# Altium schematic sheet Kivipallur_joonis3_toide.SchDoc
size A4; SheetNumber: 4; SheetTotal: 4
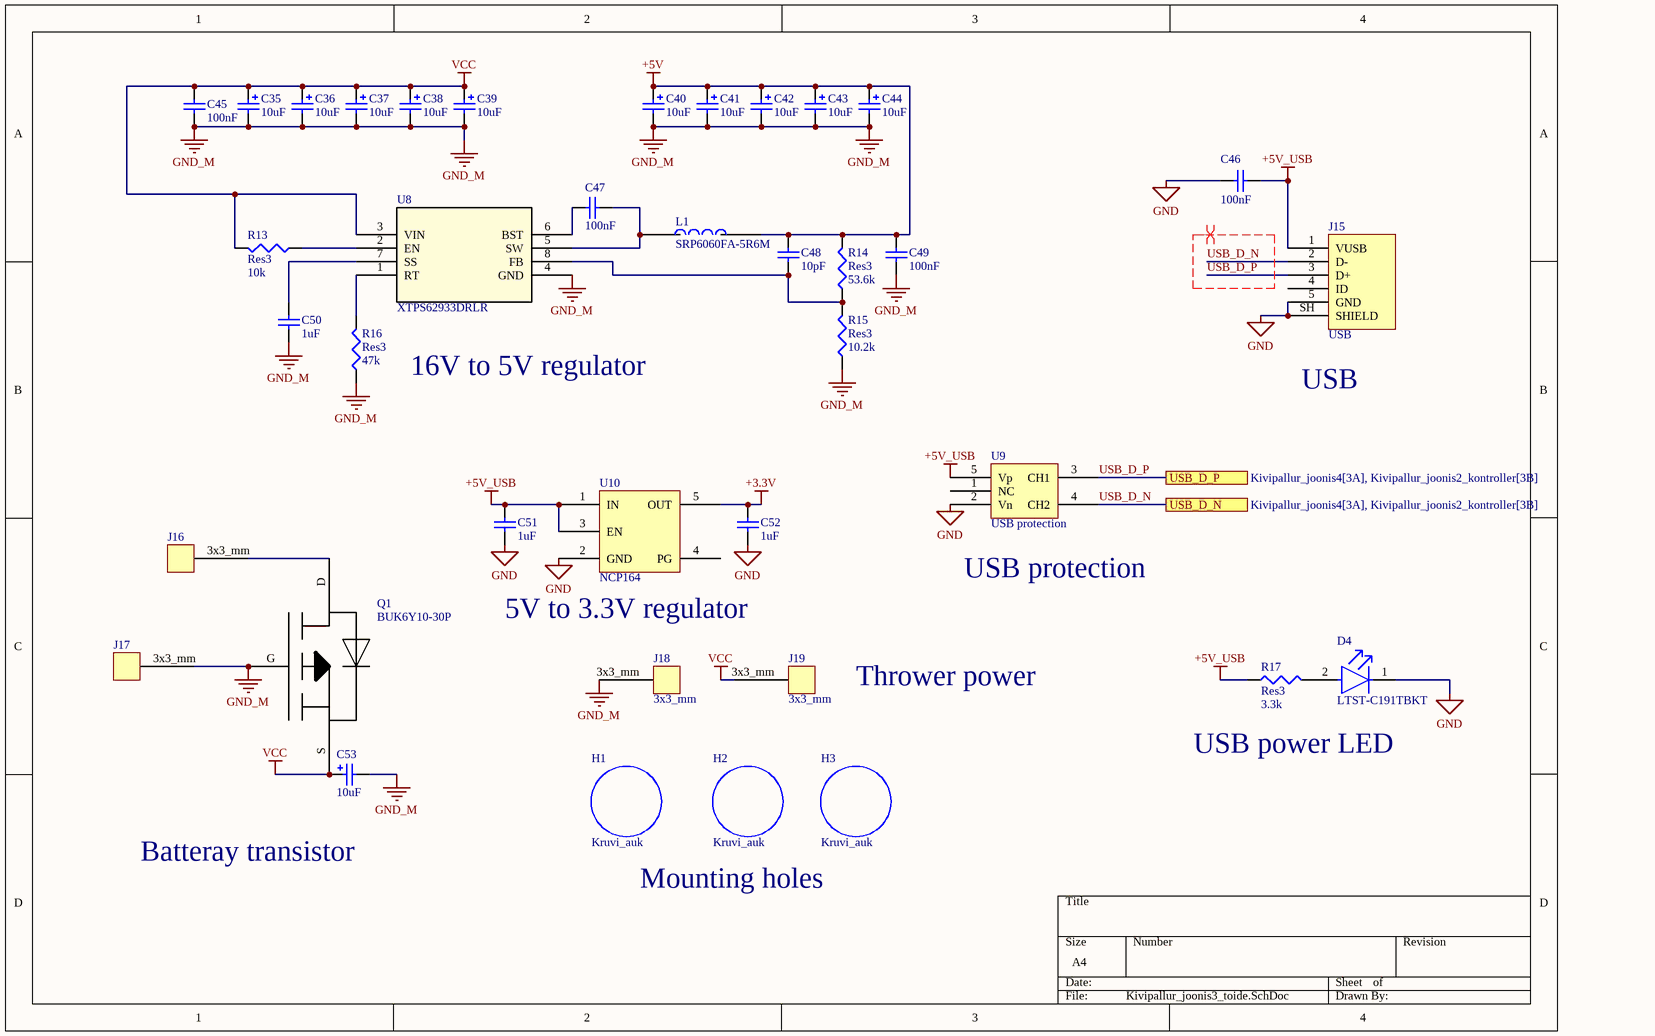
[diagram p0: Kivipallur_joonis3_toide.SchDoc]

## Parts
C35  value 10uF  [C0805]  (hidden comment: Cap Pol3)
C36  value 10uF  [C0805]  (hidden comment: Cap Pol3)
C37  value 10uF  [C0805]  (hidden comment: Cap Pol3)
C38  value 10uF  [C0805]  (hidden comment: Cap Pol3)
C39  value 10uF  [C0805]  (hidden comment: Cap Pol3)
C40  value 10uF  [C0805]  (hidden comment: Cap Pol3)
C41  value 10uF  [C0805]  (hidden comment: Cap Pol3)
C42  value 10uF  [C0805]  (hidden comment: Cap Pol3)
C43  value 10uF  [C0805]  (hidden comment: Cap Pol3)
C44  value 10uF  [C0805]  (hidden comment: Cap Pol3)
C45  value 100nF  [1608[0603]]  (hidden comment: Cap Semi)
C46  value 100nF  [1608[0603]]  (hidden comment: Cap Semi)
C47  value 100nF  [1608[0603]]  (hidden comment: Cap Semi)
C48  value 10pF  [1608[0603]]  (hidden comment: Cap Semi)
C49  value 100nF  [1608[0603]]  (hidden comment: Cap Semi)
C50  value 1uF  [1608[0603]]  (hidden comment: Cap Semi)
C51  value 1uF  [1608[0603]]  (hidden comment: Cap Semi)
C52  value 1uF  [1608[0603]]  (hidden comment: Cap Semi)
C53  value 10uF  [C0805]  (hidden comment: Cap Pol3)
D4  LTST-C191TBKT  [FP-LTST-C191TBKT-MFG]
H1  Kruvi_auk  [kruvi_auk]
H2  Kruvi_auk  [kruvi_auk]
H3  Kruvi_auk  [kruvi_auk]
J15  USB  [USB]
J16  3x3_mm  [3x3_mm]  (value not drawn)
J17  3x3_mm  [3x3_mm]  (value not drawn)
J18  3x3_mm  [3x3_mm]
J19  3x3_mm  [3x3_mm]
L1  SRP6060FA-5R6M  [test alus]
Q1  BUK6Y10-30P  [BUK6Y10-30P]
R13  Res3  value 10k  [J1-0603]
R14  Res3  value 53.6k  [J1-0603]
R15  Res3  value 10.2k  [J1-0603]
R16  Res3  value 47k  [J1-0603]
R17  Res3  value 3.3k  [J1-0603]
U8  XTPS62933DRLR  [SOT_33DRLR_TEX]
U9  USB protection  [USB_PROTECTION_3]
U10  NCP164  [NCP164_2]

## Ports
USB_D_N (see Kivipallur_joonis4[3A], Kivipallur_joonis2_kontroller[3B]), USB_D_P (see Kivipallur_joonis4[3A], Kivipallur_joonis2_kontroller[3B])

## Nets
+3.3V: C52.1 U10.5(OUT)
+5V: C40.1 C41.1 C42.1 C43.1 C44.1 C48.1 C49.1 L1.2 R14.2
+5V_USB: C46.1 C51.1 J15.1(VUSB) R17.1 U9.5(Vp) U10.1(IN) U10.3(EN)
GND: C46.2 C51.2 C52.2 D4.1(C) J15.5(GND) J15.SH(SHIELD) U9.2(Vn) U10.2(GND)
GND_M: C35.2 C36.2 C37.2 C38.2 C39.2 C40.2 C41.2 C42.2 C43.2 C44.2 C45.2 C49.2 C50.2 C53.2 J17.3x3_mm J18.3x3_mm Q1.G R15.1 R16.1 U8.4(GND)
VCC: C35.1 C36.1 C37.1 C38.1 C39.1 C45.1 C53.1 J19.3x3_mm Q1.S R13.2 U8.3(VIN)
USB_D_N: J15.2(D-) U9.4(CH2) ; port USB_D_N
USB_D_P: J15.3(D+) U9.3(CH1) ; port USB_D_P
NetC47_1: C47.1 U8.6(BST)
NetC47_2: C47.2 L1.1 U8.5(SW)
NetC48_2: C48.2 R14.1 R15.2 U8.8(FB)
NetC50_1: C50.1 U8.7(SS)
NetD4_2: D4.2(A) R17.2
NetJ16_3x3_mm: J16.3x3_mm Q1.D
NetR13_1: R13.1 U8.2(EN)
NetR16_2: R16.2 U8.1(RT)

Not connected (* = marked no-connect by the designer): J15 4(ID); U9 1(NC); U10 4(PG)

## Layout directives
differential pair; differential pair class USB: USB_D_N, USB_D_P

## Notes on the sheet
- 16V to 5V regulator
- (near J15) USB
- (near U9) USB protection
- 5V to 3.3V regulator
- Thrower power
- USB power LED
- Batteray transistor
- Mounting holes

## Library data of the parts
C35-C44 C53 = Cap Pol3: Polarized Capacitor (Surface Mount); Published: 8-Jun-2000; PackageReference: C0805; Publisher: Altium Limited; PackageDescription: Chip Capacitor; LatestRevisionDate: 29-May-2009; LatestRevisionNote: IPC-7351 Footprint Added.
C45-C52 = Cap Semi: Capacitor (Semiconductor SIM Model); Published: 8-Jun-2000; PackageReference: C1206; Publisher: Altium Limited; PackageDescription: Chip Capacitor; LatestRevisionDate: 29-May-2009; LatestRevisionNote: IPC-7351 Footprint Added.
D4 = CMP-22017-000008-1: LED BLUE CLEAR CHIP SMD; Lens Color: Colorless; Dominant Wavelength: 475nm; Forward Current: 20mA; Wavelength: 468nm; Viewing Angle: 130°; Power Dissipation: 76mW; Luminous Intensity: 180mcd; Reverse Voltage: 5V; Number of Elements: 1; Lens Style: Diffused; Forward Voltage: 3.8V; Max Power Dissipation: 75mW; Case Code (Metric): 1608; Packaging: Tape and Reel; Case/Package: 0603; Depth: 1.6mm; Mount: Surface Mount; Lead Free: Lead Free; Min Operating Temperature: -20°C; Lens Transparency: Clear; Illumination Color: Blue; Height: 0.55mm; Test Current: 20mA; Case Code (Imperial): 0603; Max Operating Temperature: 80°C; Number of Pins: 2; Length: 0.8mm; Radiation Hardening: No; Package Quantity: 1; Number of LEDs: 1; Width: 0.8mm; Color: Blue
R13-R17 = Res3: Resistor; Published: 8-Jun-2000; LatestRevisionDate: 29-May-2009; LatestRevisionNote: IPC-7351 Footprint Added.; PackageReference: J1-0603; Publisher: Altium Limited; PackageDescription: Chip Resistor
U8 = XTPS62933DRLR: No Description Available; Mfr_Name: Texas Instruments; Copyright: Copyright (C) 2022 Ultra Librarian. All rights reserved.; Manufacturer_Part_Number: XTPS62933DRLR; RefDes: RefDes; Type: DEV